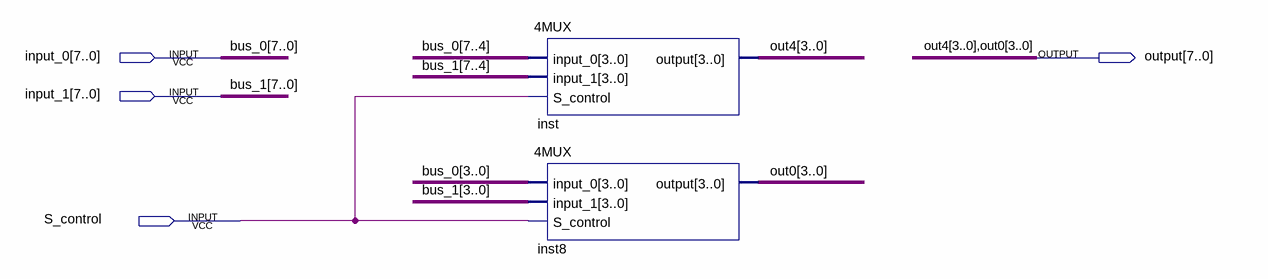
[diagram p0: schematic sheet]
// Quartus schematic 8MUX.bdf as structural Verilog: 2 symbols, 4 pins
module \8MUX  (
  input  [7:0] input_0,
  input  [7:0] input_1,
  input  S_control,
  output [7:0] \output 
);

  \4MUX  inst (.input_0(input_0[7:4]), .input_1(input_1[7:4]), .S_control(S_control), .\output (\output [7:4]));
  \4MUX  inst8 (.input_0(input_0[3:0]), .input_1(input_1[3:0]), .S_control(S_control), .\output (\output [3:0]));

  // Other names for the same wires on the sheet: bus_0[7:0] = input_0; bus_1[7:0] = input_1;
  //   out0[3:0] = \output [3:0]; out4[3:0] = \output [7:4]
endmodule
